# EAGLE schematic jamma-streamer (EAGLE 9.6.2)

## Sheet 1 of 7: Jamma extender and VGA/audio outputs
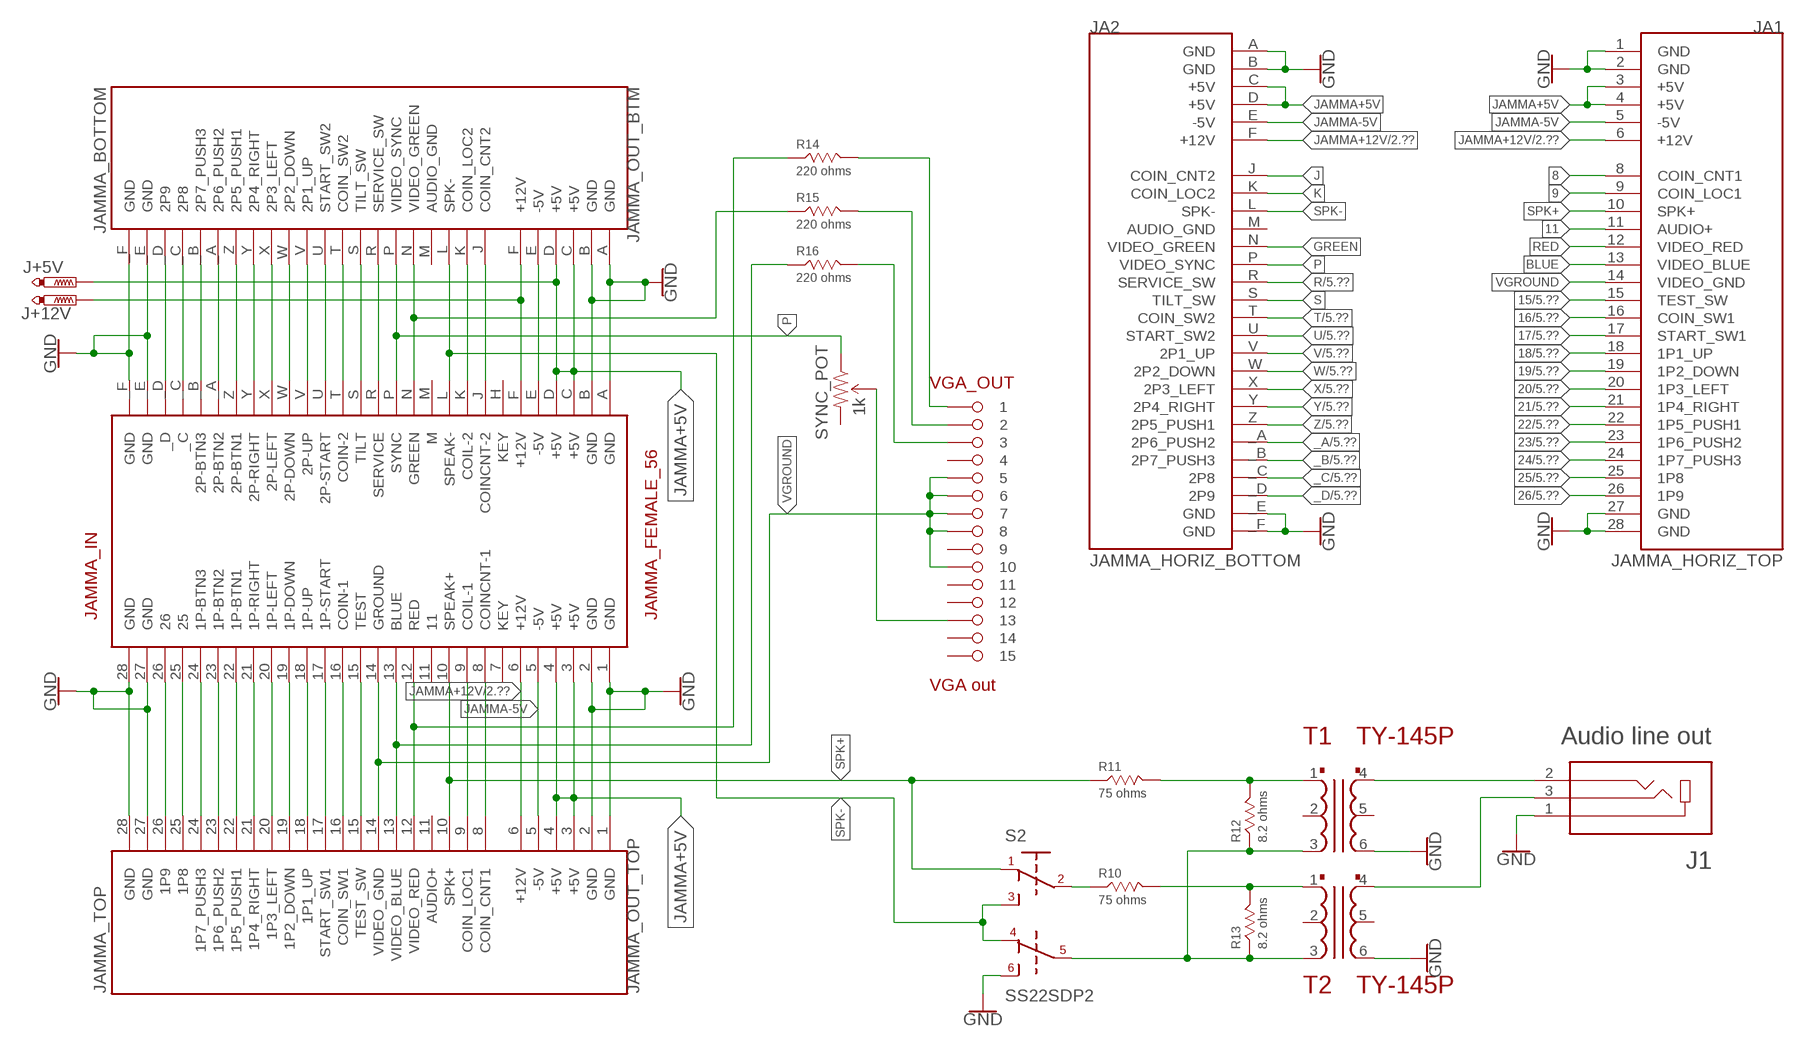
[diagram p0: schematic, sheet 1]

### Parts
J1  Audio line out  SJ1-3523N  [CUI_SJ1-3523N]
J+5V  PTR1TP15SQ  [TP15SQ]
J+12V  PTR1TP15SQ  [TP15SQ]
JA1  JAMMA_HORIZ_TOP  [JAMMA_HORIZ_TOP]
JA2  JAMMA_HORIZ_BOTTOM  [JAMMA_HORIZ_BOTTOM]
JAMMA_IN  JAMMA_FEMALE_56  [JAMMA_FEMALE_56]
JAMMA_OUT_BTM  JAMMA_BOTTOM  [JAMMA_BOTTOM]
JAMMA_OUT_TOP  JAMMA_TOP  [JAMMA_TOP]
R10  75 ohms  TE3550  [TE_3550_SERIES]
R11  75 ohms  TE3550  [TE_3550_SERIES]
R12  8.2 ohms  TE3550  [TE_3550_SERIES]
R13  8.2 ohms  TE3550  [TE_3550_SERIES]
R14  220 ohms  ERJ-14NF2200U  [RESC3225X70N]
R15  220 ohms  ERJ-14NF2200U  [RESC3225X70N]
R16  220 ohms  ERJ-14NF2200U  [RESC3225X70N]
S2  SS22SDP2  [SS22SDP2(DPDT)]
SYNC_POT  1k  TRIMPOTPTH  [TRIM_POT_PTH]
T1  TY-145P  TRIAD-TY-145P  [TRIAD-TY-145P]
T2  TY-145P  TRIAD-TY-145P  [TRIAD-TY-145P]
VGA_OUT  VGA out  HARTING-DSUB-15-FEMALE  [HARTING-DSUB-15-FEMALE]

### Nets
8: JA1.8(COIN_CNT1) JAMMA_IN.8(COINCNT-1) JAMMA_OUT_TOP.8(COIN_CNT1)
9: JA1.9(COIN_LOC1) JAMMA_IN.9(COIL-1) JAMMA_OUT_TOP.9(COIN_LOC1)
11: JA1.11(AUDIO+)
15: JA1.15(TEST_SW) JAMMA_IN.15(TEST) JAMMA_OUT_TOP.15(TEST_SW) ; also sheet 5
16: JA1.16(COIN_SW1) JAMMA_IN.16(COIN-1) JAMMA_OUT_TOP.16(COIN_SW1) ; also sheet 5
17: JA1.17(START_SW1) JAMMA_IN.17(1P-START) JAMMA_OUT_TOP.17(START_SW1) ; also sheet 5
18: JA1.18(1P1_UP) JAMMA_IN.18(1P-UP) JAMMA_OUT_TOP.18(1P1_UP) ; also sheet 5
19: JA1.19(1P2_DOWN) JAMMA_IN.19(1P-DOWN) JAMMA_OUT_TOP.19(1P2_DOWN) ; also sheet 5
20: JA1.20(1P3_LEFT) JAMMA_IN.20(1P-LEFT) JAMMA_OUT_TOP.20(1P3_LEFT) ; also sheet 5
21: JA1.21(1P4_RIGHT) JAMMA_IN.21(1P-RIGHT) JAMMA_OUT_TOP.21(1P4_RIGHT) ; also sheet 5
22: JA1.22(1P5_PUSH1) JAMMA_IN.22(1P-BTN1) JAMMA_OUT_TOP.22(1P5_PUSH1) ; also sheet 5
23: JA1.23(1P6_PUSH2) JAMMA_IN.23(1P-BTN2) JAMMA_OUT_TOP.23(1P6_PUSH2) ; also sheet 5
24: JA1.24(1P7_PUSH3) JAMMA_IN.24(1P-BTN3) JAMMA_OUT_TOP.24(1P7_PUSH3) ; also sheet 5
25: JA1.25(1P8) JAMMA_IN.25 JAMMA_OUT_TOP.25(1P8) ; also sheet 5
26: JA1.26(1P9) JAMMA_IN.26 JAMMA_OUT_TOP.26(1P9) ; also sheet 5
_A: JA2._A(2P6_PUSH2) JAMMA_IN._A(2P-BTN2) JAMMA_OUT_BTM._A(2P6_PUSH2) ; also sheet 5
_B: JA2._B(2P7_PUSH3) JAMMA_IN._B(2P-BTN3) JAMMA_OUT_BTM._B(2P7_PUSH3) ; also sheet 5
_C: JA2._C(2P8) JAMMA_IN._C JAMMA_OUT_BTM._C(2P8) ; also sheet 5
_D: JA2._D(2P9) JAMMA_IN._D JAMMA_OUT_BTM._D(2P9) ; also sheet 5
BLUE: JA1.13(VIDEO_BLUE) JAMMA_IN.13(BLUE) JAMMA_OUT_TOP.13(VIDEO_BLUE) R16.1
GND: J1.1 JA1.1(GND) JA1.2(GND) JA1.27(GND) JA1.28(GND) JA2._E(GND) JA2._F(GND) JA2.A(GND) JA2.B(GND) JAMMA_IN.1(GND) JAMMA_IN.2(GND) JAMMA_IN.27(GND) JAMMA_IN.28(GND) JAMMA_IN._E(GND) JAMMA_IN._F(GND) JAMMA_IN.A(GND) JAMMA_IN.B(GND) JAMMA_OUT_BTM._E(GND) JAMMA_OUT_BTM._F(GND) JAMMA_OUT_BTM.A(GND) JAMMA_OUT_BTM.B(GND) JAMMA_OUT_TOP.1(GND) JAMMA_OUT_TOP.2(GND) JAMMA_OUT_TOP.27(GND) JAMMA_OUT_TOP.28(GND) S2.6 T1.6 T2.6 ; also sheet 2,3,4,5,6,7
GREEN: JA2.N(VIDEO_GREEN) JAMMA_IN.N(GREEN) JAMMA_OUT_BTM.N(VIDEO_GREEN) R15.1
J: JA2.J(COIN_CNT2) JAMMA_IN.J(COINCNT-2) JAMMA_OUT_BTM.J(COIN_CNT2)
JAMMA+5V: J+5V.TP JA1.3(+5V) JA1.4(+5V) JA2.C(+5V) JA2.D(+5V) JAMMA_IN.3(+5V) JAMMA_IN.4(+5V) JAMMA_IN.C(+5V) JAMMA_IN.D(+5V) JAMMA_OUT_BTM.C(+5V) JAMMA_OUT_BTM.D(+5V) JAMMA_OUT_TOP.3(+5V) JAMMA_OUT_TOP.4(+5V)
JAMMA+12V: J+12V.TP JA1.6(+12V) JA2.F(+12V) JAMMA_IN.6(+12V) JAMMA_IN.F(+12V) JAMMA_OUT_BTM.F(+12V) JAMMA_OUT_TOP.6(+12V) ; also sheet 2
JAMMA-5V: JA1.5(-5V) JA2.E(-5V) JAMMA_IN.5(-5V) JAMMA_IN.E(-5V) JAMMA_OUT_BTM.E(-5V) JAMMA_OUT_TOP.5(-5V)
K: JA2.K(COIN_LOC2) JAMMA_IN.K(COIL-2) JAMMA_OUT_BTM.K(COIN_LOC2)
N$1: R14.2 VGA_OUT.1
N$2: R15.2 VGA_OUT.2
N$3: SYNC_POT.2(WIPER) VGA_OUT.13
N$4: R10.1 S2.2
N$11: R11.2 R12.2 T1.1
N$14: R10.2 R13.2 T2.1
N$16: R16.2 VGA_OUT.3
N$25: R12.1 R13.1 S2.5 T1.3 T2.3
N$26: J1.2 T1.4
N$30: J1.3 T2.4
P: JA2.P(VIDEO_SYNC) JAMMA_IN.P(SYNC) JAMMA_OUT_BTM.P(VIDEO_SYNC) SYNC_POT.1(CCW)
R: JA2.R(SERVICE_SW) JAMMA_IN.R(SERVICE) JAMMA_OUT_BTM.R(SERVICE_SW) ; also sheet 5
RED: JA1.12(VIDEO_RED) JAMMA_IN.12(RED) JAMMA_OUT_TOP.12(VIDEO_RED) R14.1
S: JA2.S(TILT_SW) JAMMA_IN.S(TILT) JAMMA_OUT_BTM.S(TILT_SW)
SPK+: JA1.10(SPK+) JAMMA_IN.10(SPEAK+) JAMMA_OUT_TOP.10(SPK+) R11.1 S2.1
SPK-: JA2.L(SPK-) JAMMA_IN.L(SPEAK-) JAMMA_OUT_BTM.L(SPK-) S2.3 S2.4
T: JA2.T(COIN_SW2) JAMMA_IN.T(COIN-2) JAMMA_OUT_BTM.T(COIN_SW2) ; also sheet 5
U: JA2.U(START_SW2) JAMMA_IN.U(2P-START) JAMMA_OUT_BTM.U(START_SW2) ; also sheet 5
V: JA2.V(2P1_UP) JAMMA_IN.V(2P-UP) JAMMA_OUT_BTM.V(2P1_UP) ; also sheet 5
VGROUND: JA1.14(VIDEO_GND) JAMMA_IN.14(GROUND) JAMMA_OUT_TOP.14(VIDEO_GND) VGA_OUT.5 VGA_OUT.6 VGA_OUT.7 VGA_OUT.8 VGA_OUT.10
W: JA2.W(2P2_DOWN) JAMMA_IN.W(2P-DOWN) JAMMA_OUT_BTM.W(2P2_DOWN) ; also sheet 5
X: JA2.X(2P3_LEFT) JAMMA_IN.X(2P-LEFT) JAMMA_OUT_BTM.X(2P3_LEFT) ; also sheet 5
Y: JA2.Y(2P4_RIGHT) JAMMA_IN.Y(2P-RIGHT) JAMMA_OUT_BTM.Y(2P4_RIGHT) ; also sheet 5
Z: JA2.Z(2P5_PUSH1) JAMMA_IN.Z(2P-BTN1) JAMMA_OUT_BTM.Z(2P5_PUSH1) ; also sheet 5
Unconnected: JA2.M(AUDIO_GND) JAMMA_IN.7(KEY) JAMMA_IN.11 JAMMA_IN.H(KEY) JAMMA_IN.M JAMMA_OUT_BTM.M(AUDIO_GND) JAMMA_OUT_TOP.11(AUDIO+) SYNC_POT.3(CW) T1.2 T1.5 T2.2 T2.5 VGA_OUT.4 VGA_OUT.9 VGA_OUT.11 VGA_OUT.12 VGA_OUT.14 VGA_OUT.15

## Sheet 2 of 7: Alimentation 12V -> 5V -> 3.3V
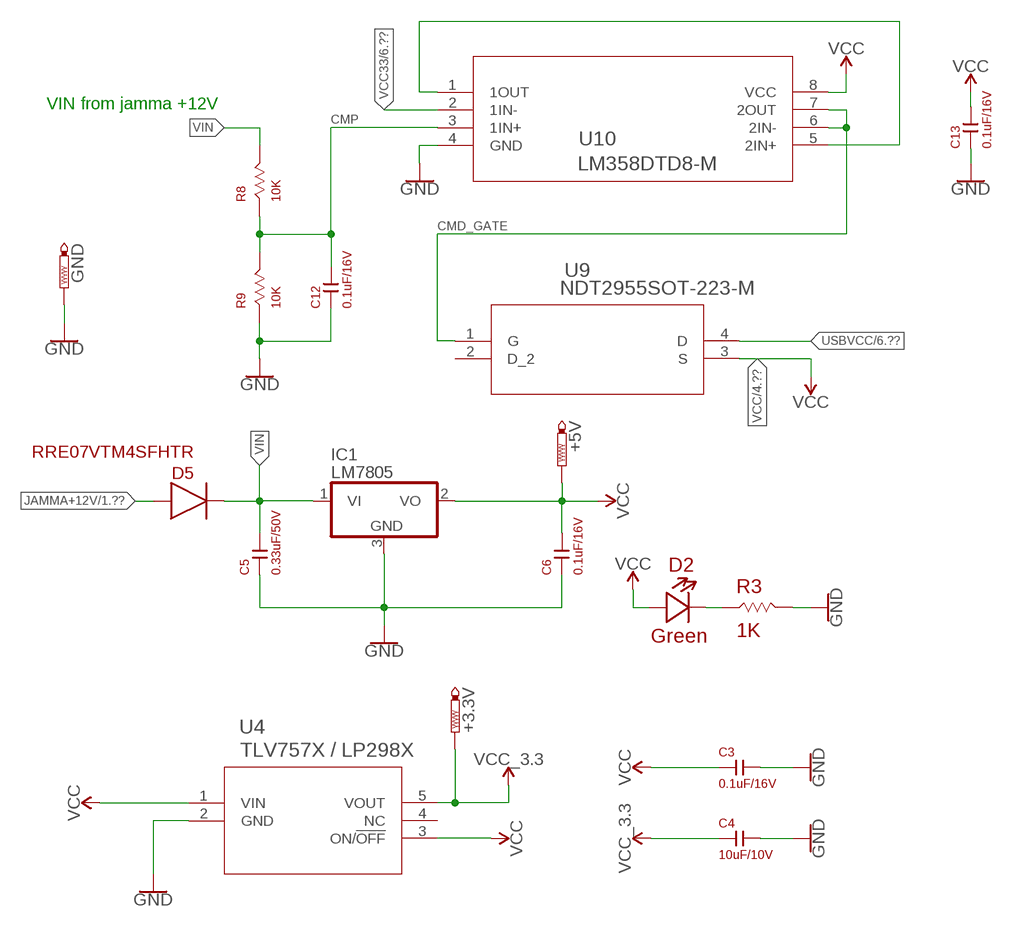
[diagram p1: schematic, sheet 2]

### Parts
+3.3V  PTR1TP15SQ  [TP15SQ]
+5V  PTR1TP15SQ  [TP15SQ]
C3  0.1uF/16V  KEMET-C1210C104K4J  [KEMET-C1210C104K4J]
C4  10uF/10V  KEMET-C1210C106K8N  [KEMET-C1210C106K8N]
C5  0.33uF/50V  KEMET-C1206X334K5R  [KEMET-C1206X334K5R]
C6  0.1uF/16V  KEMET-C1210C104K4J  [KEMET-C1210C104K4J]
C12  0.1uF/16V  KEMET-C1210C104K4J  [KEMET-C1210C104K4J]
C13  0.1uF/16V  KEMET-C1210C104K4J  [KEMET-C1210C104K4J]
D2  Green  604-APTD1608LCGCK  [604-APTD1608LCGCK]
D5  RRE07VTM4SFHTR  [DIODE-RRE07VTM4SFHTR]
GND  PTR1TP15SQ  [TP15SQ]
IC1  LM7805  7805DT  [TO252]
R3  1K  BOURNS-652CHP0603FX1001ELF  [652-CHP0603FX1001ELF]
R8  10K  BOURNS-CRM2512AJW103ELF  [BOURNS-CRM2512AJW-103ELF]
R9  10K  BOURNS-CRM2512AJW103ELF  [BOURNS-CRM2512AJW-103ELF]
U4  TLV757X / LP298X  LP2981-33DBVRDBV5-M  [DBV5-M]
U9  NDT2955SOT-223-M  [SOT-223-M]
U10  LM358DTD8-M  [D8-M]

### Nets
CMD_GATE: U9.1(G) U10.6(2IN-) U10.7(2OUT)
CMP: C12.1 R8.1 R9.2 U10.3(1IN+)
GND: C3.1 C4.1 C5.2 C6.2 C12.2 C13.2 GND.TP IC1.3(GND) R3.2 R9.1 U4.2(GND) U10.4(GND) ; also sheet 1,3,4,5,6,7
JAMMA+12V: D5.2 ; also sheet 1
N$12: D2.- R3.1
N$23: U10.1(1OUT) U10.5(2IN+)
USBVCC: U9.4(D) ; also sheet 6
VCC: +5V.TP C3.2 C6.1 C13.1 D2.+ IC1.2(VO) U4.1(VIN) U4.3(ON/!OFF) U9.3(S) U10.8(VCC) ; also sheet 4,5,7
VCC33: U10.2(1IN-) ; also sheet 6
VCC_2: +3.3V.TP C4.2 U4.5(VOUT) ; supply symbol labelled VCC_3.3 ; also sheet 3
VIN: C5.1 D5.1 IC1.1(VI) R8.2
Unconnected: U4.4(NC) U9.2(D_2)

### Notes on the sheet
- VIN from jamma +12V

## Sheet 3 of 7: Micro SD CARD related circuitry
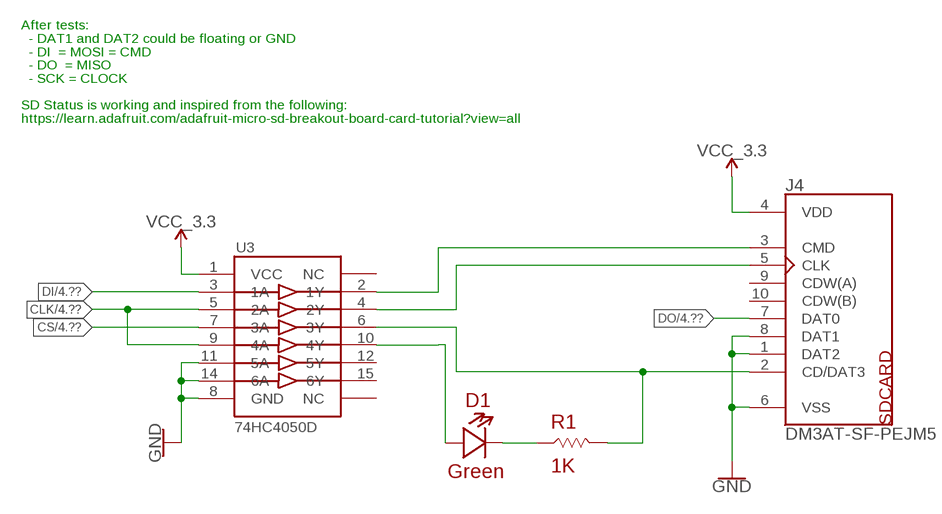
[diagram p2: schematic, sheet 3]

### Parts
D1  Green  604-APTD1608LCGCK  [604-APTD1608LCGCK]
J4  DM3AT-SF-PEJM5  [DM3AT-SF-PEJM5_1]
R1  1K  BOURNS-652CHP0603FX1001ELF  [652-CHP0603FX1001ELF]
U3  74HC4050D  [SO16]

### Nets
CLK: U3.5(2A) U3.9(4A) ; also sheet 4
CS: U3.7(3A) ; also sheet 4,6
DI: U3.3(1A) ; also sheet 4
DO: J4.7(DAT0) ; also sheet 4
GND: J4.1(DAT2) J4.6(VSS) J4.8(DAT1) U3.8(GND) U3.11(5A) U3.14(6A) ; also sheet 1,2,4,5,6,7
N$18: D1.+ U3.10(4Y)
N$19: D1.- R1.1
SD_CLK: J4.5(CLK) U3.4(2Y)
SD_CMD: J4.3(CMD) U3.2(1Y)
SD_CS: J4.2(CD/DAT3) R1.2 U3.6(3Y)
VCC_2: J4.4(VDD) U3.1(VCC) ; supply symbol labelled VCC_3.3 ; also sheet 2
Unconnected: J4.9(CDW(A)) J4.10(CDW(B)) U3.12(5Y) U3.13(NC) U3.15(6Y) U3.16(NC)

### Notes on the sheet
- After tests:
    - DAT1 and DAT2 could be floating or GND
    - DI  = MOSI = CMD
    - DO  = MISO
    - SCK = CLOCK
  
  SD Status is working and inspired from the following:
  https://learn.adafruit.com/adafruit-micro-sd-breakout-board-card-tutorial?view=all

## Sheet 4 of 7: Atmega 328P
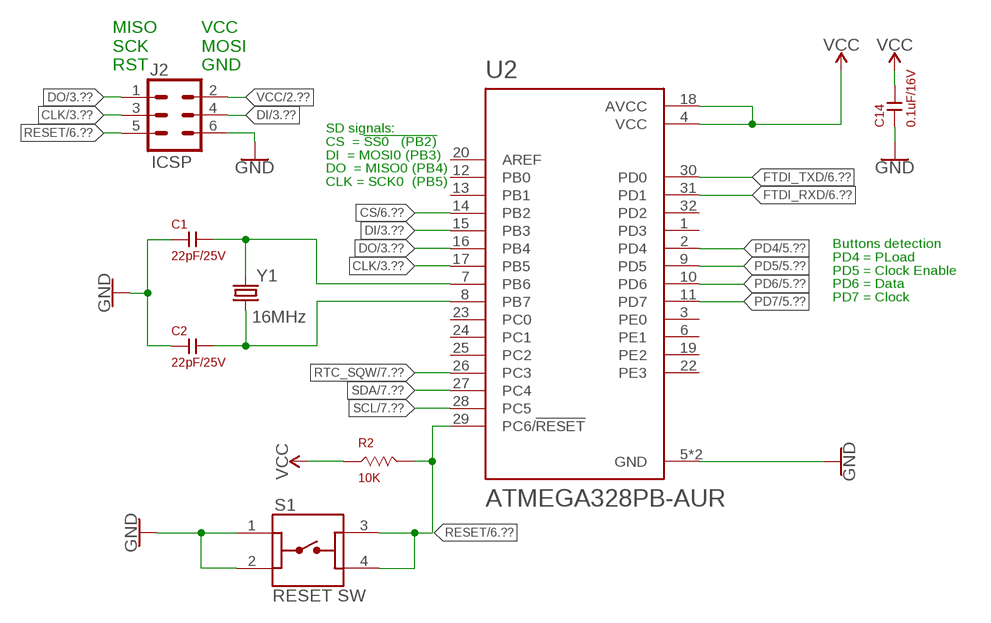
[diagram p3: schematic, sheet 4]

### Parts
C1  22pF/25V  KEMET-C1206C220K3HACTU  [KEMET-C1206C220K3HACTU]
C2  22pF/25V  KEMET-C1206C220K3HACTU  [KEMET-C1206C220K3HACTU]
C14  0.1uF/16V  KEMET-C1210C104K4J  [KEMET-C1210C104K4J]
J2  ICSP  CONN_03X22X3_SILK_MALE_PTH  [2X3]
R2  10K  BOURNS-CRM2512AJW103ELF  [BOURNS-CRM2512AJW-103ELF]
S1  RESET SW  1825910-7  [SW_1825910-7]
U2  ATMEGA328PB-AUR  [QFP80P900X900X120-32N]
Y1  16MHz  CRYSTAL-16MHZPTH-HC49US  [HC49US]

### Nets
CLK: J2.3 U2.17(PB5) ; also sheet 3
CS: U2.14(PB2) ; also sheet 3,6
DI: J2.4 U2.15(PB3) ; also sheet 3
DO: J2.1 U2.16(PB4) ; also sheet 3
FTDI_RXD: U2.31(PD1) ; also sheet 6
FTDI_TXD: U2.30(PD0) ; also sheet 6
GND: C1.2 C2.2 C14.2 J2.6 S1.1 S1.2 U2.5(GND) U2.21(GND) ; also sheet 1,2,3,5,6,7
PB6: C1.1 U2.7(PB6) Y1.2
PB7: C2.1 U2.8(PB7) Y1.1
PD4: U2.2(PD4) ; also sheet 5
PD5: U2.9(PD5) ; also sheet 5
PD6: U2.10(PD6) ; also sheet 5
PD7: U2.11(PD7) ; also sheet 5
RESET: J2.5 R2.2 S1.3 S1.4 U2.29(PC6/!RESET) ; also sheet 6
RTC_SQW: U2.26(PC3) ; also sheet 7
SCL: U2.28(PC5) ; also sheet 7
SDA: U2.27(PC4) ; also sheet 7
VCC: C14.1 J2.2 R2.1 U2.4(VCC) U2.18(AVCC) ; also sheet 2,5,7
Unconnected: U2.1(PD3) U2.3(PE0) U2.6(PE1) U2.12(PB0) U2.13(PB1) U2.19(PE2) U2.20(AREF) U2.22(PE3) U2.23(PC0) U2.24(PC1) U2.25(PC2) U2.32(PD2)

### Notes on the sheet
- MISO
  SCK
  RST
- VCC
  MOSI
  GND
- SD signals:
  CS  = !SS0   (PB2)
  DI  = MOSI0 (PB3)
  DO  = MISO0 (PB4)
  CLK = SCK0  (PB5)
- Buttons detection
  PD4 = PLoad
  PD5 = Clock Enable
  PD6 = Data
  PD7 = Clock

## Sheet 5 of 7: Buttons detection
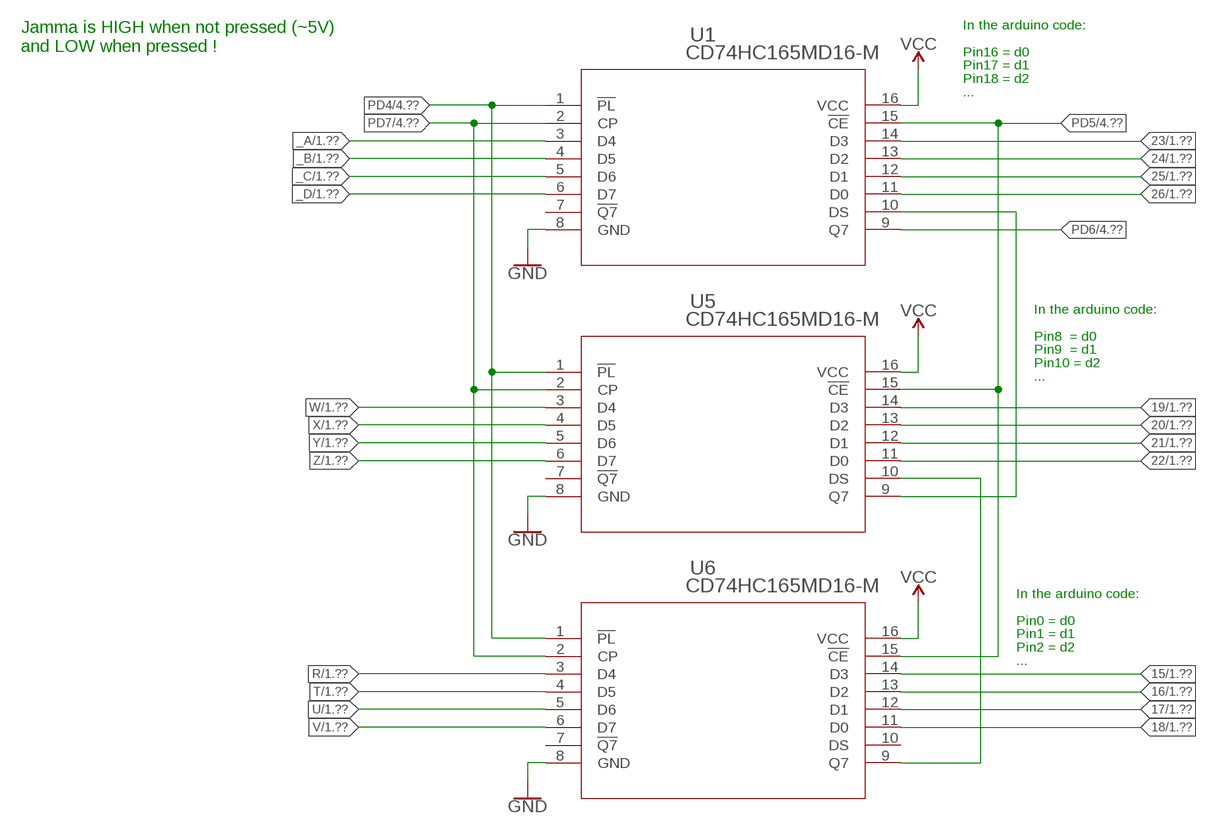
[diagram p4: schematic, sheet 5]

### Parts
U1  CD74HC165MD16-M  [D16-M]
U5  CD74HC165MD16-M  [D16-M]
U6  CD74HC165MD16-M  [D16-M]

### Nets
15: U6.14(D3) ; also sheet 1
16: U6.13(D2) ; also sheet 1
17: U6.12(D1) ; also sheet 1
18: U6.11(D0) ; also sheet 1
19: U5.14(D3) ; also sheet 1
20: U5.13(D2) ; also sheet 1
21: U5.12(D1) ; also sheet 1
22: U5.11(D0) ; also sheet 1
23: U1.14(D3) ; also sheet 1
24: U1.13(D2) ; also sheet 1
25: U1.12(D1) ; also sheet 1
26: U1.11(D0) ; also sheet 1
_A: U1.3(D4) ; also sheet 1
_B: U1.4(D5) ; also sheet 1
_C: U1.5(D6) ; also sheet 1
_D: U1.6(D7) ; also sheet 1
GND: U1.8(GND) U5.8(GND) U6.8(GND) ; also sheet 1,2,3,4,6,7
N$9: U5.10(DS) U6.9(Q7)
N$10: U1.10(DS) U5.9(Q7)
PD4: U1.1(!PL) U5.1(!PL) U6.1(!PL) ; also sheet 4
PD5: U1.15(!CE) U5.15(!CE) U6.15(!CE) ; also sheet 4
PD6: U1.9(Q7) ; also sheet 4
PD7: U1.2(CP) U5.2(CP) U6.2(CP) ; also sheet 4
R: U6.3(D4) ; also sheet 1
T: U6.4(D5) ; also sheet 1
U: U6.5(D6) ; also sheet 1
V: U6.6(D7) ; also sheet 1
VCC: U1.16(VCC) U5.16(VCC) U6.16(VCC) ; also sheet 2,4,7
W: U5.3(D4) ; also sheet 1
X: U5.4(D5) ; also sheet 1
Y: U5.5(D6) ; also sheet 1
Z: U5.6(D7) ; also sheet 1
Unconnected: U1.7(!Q7) U5.7(!Q7) U6.7(!Q7) U6.10(DS)

### Notes on the sheet
- Jamma is HIGH when not pressed (~5V)
  and LOW when pressed !
- In the arduino code:
  
  Pin16 = d0
  Pin17 = d1
  Pin18 = d2
  ...
- In the arduino code:
  
  Pin8  = d0
  Pin9  = d1
  Pin10 = d2
  ...
- In the arduino code:
  
  Pin0 = d0
  Pin1 = d1
  Pin2 = d2
  ...

## Sheet 6 of 7: USB input
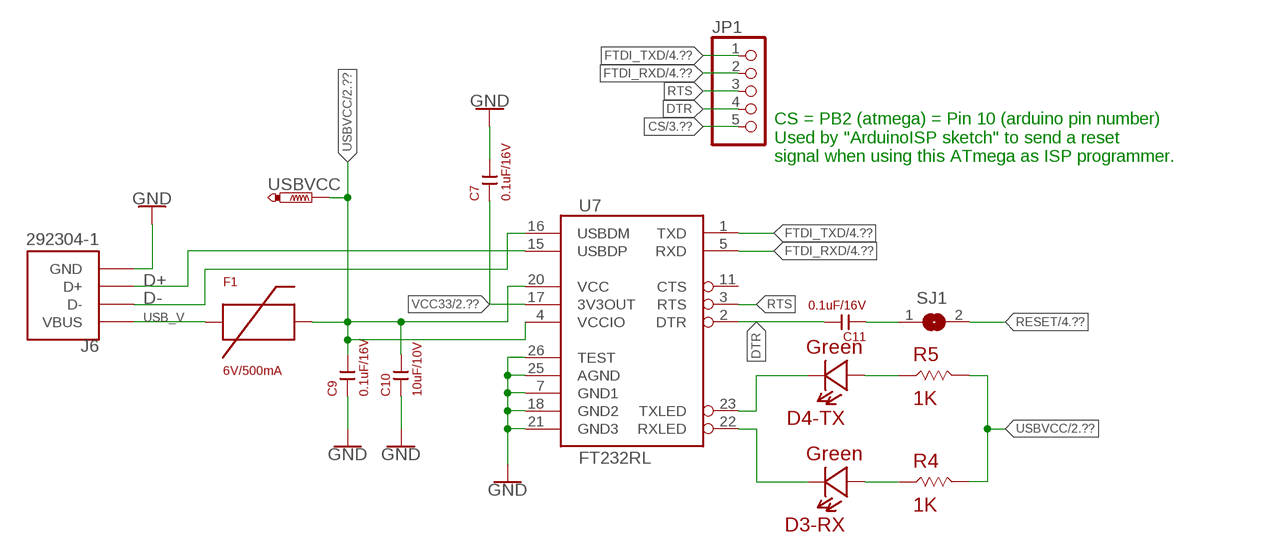
[diagram p5: schematic, sheet 6]

### Parts
C7  0.1uF/16V  KEMET-C1210C104K4J  [KEMET-C1210C104K4J]
C9  0.1uF/16V  KEMET-C1210C104K4J  [KEMET-C1210C104K4J]
C10  10uF/10V  KEMET-C1210C106K8N  [KEMET-C1210C106K8N]
C11  0.1uF/16V  KEMET-C1210C104K4J  [KEMET-C1210C104K4J]
D3-RX  Green  604-APTD1608LCGCK  [604-APTD1608LCGCK]
D4-TX  Green  604-APTD1608LCGCK  [604-APTD1608LCGCK]
F1  6V/500mA  1206L050YRSMD  [FUSE-1206L050YR]
J6  292304-1  [TE_292304-1]
JP1  PINHD-1X5  [1X05]
R4  1K  BOURNS-652CHP0603FX1001ELF  [652-CHP0603FX1001ELF]
R5  1K  BOURNS-652CHP0603FX1001ELF  [652-CHP0603FX1001ELF]
SJ1  SJ  [SJ]
U7  FT232RL  FT232RL-BASICSSOP  [SSOP28DB]
USBVCC  PTR1TP15SQ  [TP15SQ]

### Nets
CS: JP1.5 ; also sheet 3,4
D+: J6.3(D+) U7.15(USBDP)
D-: J6.2(D-) U7.16(USBDM)
DTR: C11.1 JP1.4 U7.2(DTR)
FTDI_RXD: JP1.2 U7.5(RXD) ; also sheet 4
FTDI_TXD: JP1.1 U7.1(TXD) ; also sheet 4
GND: C7.1 C9.2 C10.2 J6.4(GND) U7.7(GND1) U7.18(GND2) U7.21(GND3) U7.25(AGND) U7.26(TEST) ; also sheet 1,2,3,4,5,7
N$8: D3-RX.- U7.22(RXLED)
N$13: C11.2 SJ1.1
N$20: D4-TX.- U7.23(TXLED)
N$21: D4-TX.+ R5.1
N$22: D3-RX.+ R4.1
RESET: SJ1.2 ; also sheet 4
RTS: JP1.3 U7.3(RTS)
USB_V: F1.1 J6.1(VBUS)
USBVCC: C9.1 C10.1 F1.2 R4.2 R5.2 U7.4(VCCIO) U7.20(VCC) USBVCC.TP ; also sheet 2
VCC33: C7.2 U7.17(3V3OUT) ; also sheet 2
Unconnected: U7.11(CTS)

### Notes on the sheet
- CS = PB2 (atmega) = Pin 10 (arduino pin number)
  Used by "ArduinoISP sketch" to send a reset
  signal when using this ATmega as ISP programmer.

## Sheet 7 of 7: Real Time Clock
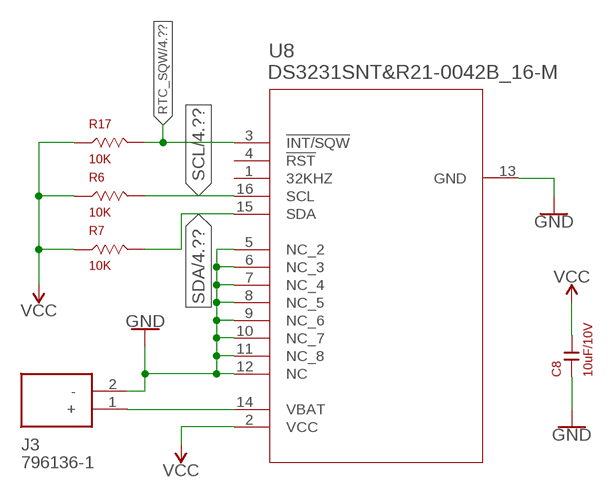
[diagram p6: schematic, sheet 7]

### Parts
C8  10uF/10V  KEMET-C1210C106K8N  [KEMET-C1210C106K8N]
J3  796136-1  [796136-1]
R6  10K  BOURNS-CRM2512AJW103ELF  [BOURNS-CRM2512AJW-103ELF]
R7  10K  BOURNS-CRM2512AJW103ELF  [BOURNS-CRM2512AJW-103ELF]
R17  10K  BOURNS-CRM2512AJW103ELF  [BOURNS-CRM2512AJW-103ELF]
U8  DS3231SNT&R21-0042B_16-M  [21-0042B_16-M]

### Nets
GND: C8.2 J3.2(-) U8.5(NC_2) U8.6(NC_3) U8.7(NC_4) U8.8(NC_5) U8.9(NC_6) U8.10(NC_7) U8.11(NC_8) U8.12(NC) U8.13(GND) ; also sheet 1,2,3,4,5,6
N$31: J3.1(+) U8.14(VBAT)
RTC_SQW: R17.2 U8.3(!INT/SQW) ; also sheet 4
SCL: R6.2 U8.16(SCL) ; also sheet 4
SDA: R7.2 U8.15(SDA) ; also sheet 4
VCC: C8.1 R6.1 R7.1 R17.1 U8.2(VCC) ; also sheet 2,4,5
Unconnected: U8.1(32KHZ) U8.4(!RST)

## Library data of the parts
+3.3V +5V GND J+5V J+12V USBVCC = testpad:PTR1: TEST PIN
C1 C2 = nma-eagle:KEMET-C1206C220K3HACTU; MOUSER_REF: 80-C1206C220K3HACTU
C3 C6 C7 C9 C11-C14 = nma-eagle:KEMET-C1210C104K4J; MOUSER_REF: 80-C1210C104K4J
C4 C8 C10 = nma-eagle:KEMET-C1210C106K8N; MOUSER_REF: 80-C1210C106K8N
C5 = nma-eagle:KEMET-C1206X334K5R; MOUSER_REF: 80-C1206X334K5R
D1 D2 D3-RX D4-TX = nma-eagle:604-APTD1608LCGCK; MOUSER_REF: 604-APTD1608LCGCK
D5 = nma-eagle:RRE07VTM4SFHTR; MOUSER_REF: 755-RRE07VTM4SFHTR
F1 = nma-eagle:1206L050YR; MOUSER_REF: 576-1206L050YR
IC1 = linear:78*: Positive VOLTAGE REGULATOR Source: http://cache.national.com/ds/LM/LM78L05.pdf http://www.fairchildsemi.com/ds/LM/LM7805.pdf; MOUSER_REF: 621-AS7805ADTR-G1
J1 = nma-eagle:SJ1-3523N: 3.5 mm Right-Angle Stereo Jack, 3 Pin PCB Mount, Non-Threaded; CUI_PURCHASE_URL: https://www.cui.com/product/interconnect/audio-connectors/jacks/3.5-mm-jacks/sj1-352xn-series?utm_source=snapeda.com&utm_medium=referral&utm_campaign=snapedaBOM; DESCRIPTION: SJ1 Series 3.5 mm 12 V Right Angle Through Hole Stereo Audio Jack; DIGI-KEY_PART_NUMBER: CP1-3523N-ND; DIGI-KEY_PURCHASE_URL: https://www.digikey.fr/product-detail/en/cui-inc/SJ1-3523N/CP1-3523N-ND/738689?utm_source=snapeda&utm_medium=aggregator&utm_campaign=symbol; MF: CUI Inc.; MOUSER_REF: 490-SJ1-3523N; MP: SJ1-3523N; PACKAGE: None; SPICEPREFIX: J
J2 = SparkFun-Connectors:CONN_03X2: Multi connection point. Often used as Generic Header-pin footprint for 0.1 inch spaced/style header connections You can populate with any combo of single row headers, but if you'd like an exact match, check these: Header - 2x3 (Male, 0.1") <https://www.sparkfun.com/products/12807> (PRT-12807) Header - 2x3 (Female, 0.1") <https://www.sparkfun.com/products/13010> (PRT-13010) 2x3 Pin Shrouded Header <https://www.sparkfun.com/products/10877> (PRT-10877) On any of the 0.1 inch spaced packages, you can populate with these: Break Away Headers - Straight <https://www.sparkfun.com/products/116> (PRT-00116) Break Away Male Headers - Right Angle <https://www.sparkfun.com/products/553> (PRT-00553) Female Headers <https://www.sparkfun.com/products/115> (PRT-00115) Break Away Headers - Machine Pin <https://www.sparkfun.com/products/117> (PRT-00117) Break Away Female Headers - Swiss Machine Pin <https://www.sparkfun.com/products/743> (PRT-00743) Special note: the shrouded connector mates well with our 3x2 ribbon cables: Ribbon Crimp Connector - 6-pin (2x3, Female) <https://www.sparkfun.com/products/10651> (PRT-10651) Ribbon Cable - 6 wire (15ft) <https://www.sparkfun.com/products/10646> (PRT-10646); MOUSER_REF: 649-773134AE26LF; PROD_ID: CONN-09701
J3 = nma-eagle:796136-1: Holder pcb 2 way Battery TE Connectivity Surface Mount Battery Holder for 1, Leaf Spring Contact Source: Datasheet; DESCRIPTION: Holder pcb 2 way Battery TE Connectivity Surface Mount Battery Holder for 1, Leaf Spring Contact; HEIGHT: mm; MANUFACTURER_NAME: TE Connectivity; MANUFACTURER_PART_NUMBER: 796136-1; MOUSER_PART_NUMBER: 571-796136-1; MOUSER_PRICE-STOCK: https://www.mouser.co.uk/ProductDetail/TE-Connectivity/796136-1?qs=PfIaAWlFPdz%252BdW7QT0YDTw%3D%3D; MOUSER_REF: 571-796136-1
J4 = nma-eagle:DM3AT-SF-PEJM5: DM3 RA SMT microSD memory card push/push DM3 RA SMT microSD memory card push/push Source: Datasheet <https://www.hirose.com/product/en/download_file/key_name/DM3AT-SF-PEJM5/category/Drawing (2D)/doc_file_id/44099/?file_category_id=6&item_id=06090031000&is_series=>; DESCRIPTION: DM3 RA SMT microSD memory card push/push DM3 RA SMT microSD memory card push/push; HEIGHT: mm; MANUFACTURER_NAME: Hirose; MANUFACTURER_PART_NUMBER: DM3AT-SF-PEJM5; MOUSER_PART_NUMBER: 798-DM3AT-SF-PEJM5; MOUSER_PRICE-STOCK: https://www.mouser.co.uk/ProductDetail/Hirose-Connector/DM3AT-SF-PEJM5?qs=LZSZKJVF%252B2WTDKp%252BR7IYAQ%3D%3D; MOUSER_REF: 798-DM3AT-SF-PEJM5
J6 = nma-eagle:292304-1: CONN USB RECEPT R/A TYPE B 4POS; COMMENT: 292304-1; DESCRIPTION: USB B R/A RECP CONNECTOR,LEAD FREE; DIGI-KEY_PART_NUMBER: A31725-ND; DIGI-KEY_PURCHASE_URL: https://www.digikey.fr/product-detail/en/te-connectivity-amp-connectors/292304-1/A31725-ND/773785?utm_source=snapeda&utm_medium=aggregator&utm_campaign=symbol; EU_ROHS_COMPLIANCE: Compliant; MF: TE Connectivity; MOUSER_REF: 571-292304-1; MP: 292304-1; PACKAGE: None; TE_PURCHASE_URL: https://www.te.com/usa-en/product-292304-1.html?te_bu=Cor&te_type=disp&te_campaign=seda_glo_cor-seda-global-disp-prtnr-fy19-seda-model-bom-cta_sma-317_1&elqCampaignId=32493
JA1 = nma-eagle:JAMMA_HORIZ_TOP
JA2 = nma-eagle:JAMMA_HORIZ_BOTTOM
JAMMA_IN = nma-eagle:JAMMA_FEMALE_56; MOUSER_REF: 798-CR7E-56DA-3.96E
JAMMA_OUT_BTM = nma-eagle:JAMMA_BOTTOM: JAMMA Connector Bottom Solder side for these card-edge connenctors HIROSE CR7E-56DA-3.96E HIROSE CR7E-56DB-3.96E KEL 1168-056-009
JAMMA_OUT_TOP = nma-eagle:JAMMA_TOP: JAMMA Connector Top Parts side for these card-edge connenctors HIROSE CR7E-56DA-3.96E HIROSE CR7E-56DB-3.96E KEL 1168-056-009
JP1 = pinhead:PINHD-1X5: PIN HEADER; MOUSER_REF: 798-A23PA254DSA71
R1 R3-R5 = nma-eagle:BOURNS-652CHP0603FX1001ELF; MOUSER_REF: 652-CHP0603FX1001ELF
R2 R6-R9 R17 = nma-eagle:BOURNS-CRM2512AJW103ELF; MOUSER_REF: 652-CRM2512AJW103ELF
R10 R11 = nma-eagle:TE3550: TE Connectivity - SMD High Power Resistors; DATASHEET: https://www.mouser.fr/datasheet/2/418/4/NG_DS_1773204-6_A-1533241.pdf; MOUSER_REF: 279-355075RFT; POWER: 5W
R12 R13 = nma-eagle:TE3550: TE Connectivity - SMD High Power Resistors; DATASHEET: https://www.mouser.fr/datasheet/2/418/4/NG_DS_1773204-6_A-1533241.pdf; MOUSER_REF: 279-35508R2JT; POWER: 5W
R14-R16 = nma-eagle:ERJ-14NF2200U: Thick Film Resistors - SMD 1210 220ohms 1% AEC-Q200 Source: Datasheet <https://industrial.panasonic.com/cdbs/www-data/pdf/RDA0000/AOA0000C84.pdf>; DESCRIPTION: Thick Film Resistors - SMD 1210 220ohms 1% AEC-Q200; HEIGHT: 0.7mm; MANUFACTURER_NAME: Panasonic; MANUFACTURER_PART_NUMBER: ERJ-14NF2200U; MOUSER_PART_NUMBER: 667-ERJ-14NF2200U; MOUSER_PRICE-STOCK: https://www.mouser.co.uk/ProductDetail/Panasonic/ERJ-14NF2200U?qs=cYDwVL8Dk%2FntiwgKbjgkoQ%3D%3D; MOUSER_REF: 667-ERJ-14NF2200U
S1 = nma-eagle:1825910-7: Switch Tactile OFF (ON) SPST Round Button PC Pins 0.05A 24VDC 100000Cycles 2.55N Thru-Hole Loose; COMMENT: 1825910-7; CONFIGURATION_POLE-THROW: Single Pole - Single Throw; CONTACT_CURRENT_RATING: 50 mA; DESCRIPTION: FSM4JAH=6MM TACT SWITCH, HIGH TEMP; DIGI-KEY_PART_NUMBER: 450-1804-ND; DIGI-KEY_PURCHASE_URL: https://www.digikey.com/product-detail/en/te-connectivity-alcoswitch-switches/1825910-7/450-1804-ND/1731414?utm_source=snapeda&utm_medium=aggregator&utm_campaign=symbol; EU_ROHS_COMPLIANCE: Compliant; MF: TE Connectivity; MOUSER_REF: 506-FSM4JAH; MP: 1825910-7; PACKAGE: None; TE_PURCHASE_URL: https://www.te.com/usa-en/product-1825910-7.html?te_bu=Cor&te_type=disp&te_campaign=seda_glo_cor-seda-global-disp-prtnr-fy19-seda-model-bom-cta_sma-317_1&elqCampaignId=32493
S2 = nma-eagle:SS22SDP2: NKK SWITCHES - SS22SDP2 - SLIDE SWITCH, DPDT, ON-NONE-ON Source: Datasheet <https://componentsearchengine.com/Datasheets/1/SS22SDP2.pdf>; DESCRIPTION: NKK SWITCHES - SS22SDP2 - SLIDE SWITCH, DPDT, ON-NONE-ON; HEIGHT: mm; MANUFACTURER_NAME: NKK Switches; MANUFACTURER_PART_NUMBER: SS22SDP2; MOUSER_PART_NUMBER: 633-SS22SDP2; MOUSER_REF: 633-SS22SDP2; SPICEPREFIX: X
SJ1 = jumper:SJ: SMD solder JUMPER
SYNC_POT = nma-eagle:TRIMPOT: Various small potentiometers for set-and-forget applications; MOUSER_REF: 652-3306F-1-102; PROD_ID: RES-08445
T1 T2 = nma-eagle:TRIAD-TY-145P; MOUSER_REF: 553-TY145P; SPICEPREFIX: X
U1 U5 U6 = nma-eagle:CD74HC165M; MANUFACTURER_PART_NUMBER: CD74HC165M; MOUSER_REF: 757-74HC165DBJ; VENDOR: Texas Instruments
U2 = nma-eagle:ATMEGA328PB-AUR: ATmega Series 20 MHz 32 KB Flash 2 KB SRAM 8-Bit Microcontroller - TQFP-32; DESCRIPTION: AVR microcontroller - EEPROM: 1024B - SRAM: 2kB - Flash: 32kB - TQFP32; MF: Microchip; MOUSER_REF: 556-ATMEGA328PB-AUR; MP: ATMEGA328PB-AUR; PACKAGE: TQFP-32 Microchip
U3 = nma-eagle:74HC4050D; AVAILABILITY: Unavailable; DESCRIPTION: Buffer/Converter 6-CH Non-Inverting 3-ST CMOS 16-Pin SOIC; MF: Toshiba Semiconductor; MOUSER_REF: 757-74HC4050DBJ; MP: 74HC4050D; PACKAGE: SOIC-16 Toshiba; PRICE: None
U4 = nma-eagle:LP2981-33DBVR; MANUFACTURER_PART_NUMBER: LP298133DBVR; MOUSER_REF: 595-LP2981-33DBVR; VENDOR: Texas Instruments
U7 = nma-eagle:FT232RL-BASIC: FT232RL USB UART This is the simplified version of the FT232RL unit. Only what you need, nothing you don't. FT232RL 4th Generation USB UART (USB <-> Serial) Controller. Datasheet <http://www.sparkfun.com/datasheets/IC/FT232R_v104.pdf> SparkFun Products Component <https://www.sparkfun.com/products/650> (COM-00650) SparkFun RedBot Mainboard <https://www.sparkfun.com/products/12097> (ROB-12097) SparkFun FTDI Basic Breakout - 5V <https://www.sparkfun.com/products/9716> (DEV-09716) SparkFun FTDI Basic Breakout - 3.3V <https://www.sparkfun.com/products/9873> (DEV-09873) Bus Pirate - v3.6a <https://www.sparkfun.com/products/12942> (TOL-12942) SparkFun USB to Serial Breakout - FT232RL <https://www.sparkfun.com/products/12731> (BOB-12731) SparkFun PicoBoard <https://www.sparkfun.com/products/11888> (WIG-11888) SparkFun RFID USB Reader <https://www.sparkfun.com/products/9963> (SEN-09963) LilyPad FTDI Basic Breakout - 5V <https://www.sparkfun.com/products/10275> (DEV-10275) SparkFun Stepoko <https://www.sparkfun.com/products/13899> (ROB-13899); MOUSER_REF: 895-FT232RL; PROD_ID: IC-00870
U8 = nma-eagle:DS3231SNT&R; MANUFACTURER_PART_NUMBER: DS3231SN#T&R; MOUSER_REF: 700-DS3231SN#T&R-; VENDOR: Maxim Integrated Products
U9 = nma-eagle:NDT2955; MANUFACTURER_PART_NUMBER: NDT2955; MOUSER_REF: 512-NDT2955; VENDOR: Fairchild Semiconductor
U10 = nma-eagle:LM358DT; MANUFACTURER_PART_NUMBER: LM358DT; MOUSER_REF: 595-LM358D; VENDOR: Texas Instruments
VGA_OUT = nma-eagle:HARTING-DSUB-15-FEMALE; MOUSER_REF: 617-09-56-152-7613
Y1 = nma-eagle:CRYSTAL-16MHZ: 16MHz Crystal Digikey Example <http://www.digikey.com/product-search/en?keywords=535-9122-1-ND> Frequency: 16MHz Frequency Stability: ±50ppm Frequency Tolerance: ±20ppm Load Capacitance: 18pF SparkFun Products: Pro Micro -5V/16MHz <https://www.sparkfun.com/products/12640> SparkFun Serial Enabled LCD Kit <https://www.sparkfun.com/products/10097>; MOUSER_REF: 815-ABL-16-B1U; PROD_ID: XTAL-08181; SF_ID: COM-00536